# EAGLE design alimV1 (EAGLE 6.1)
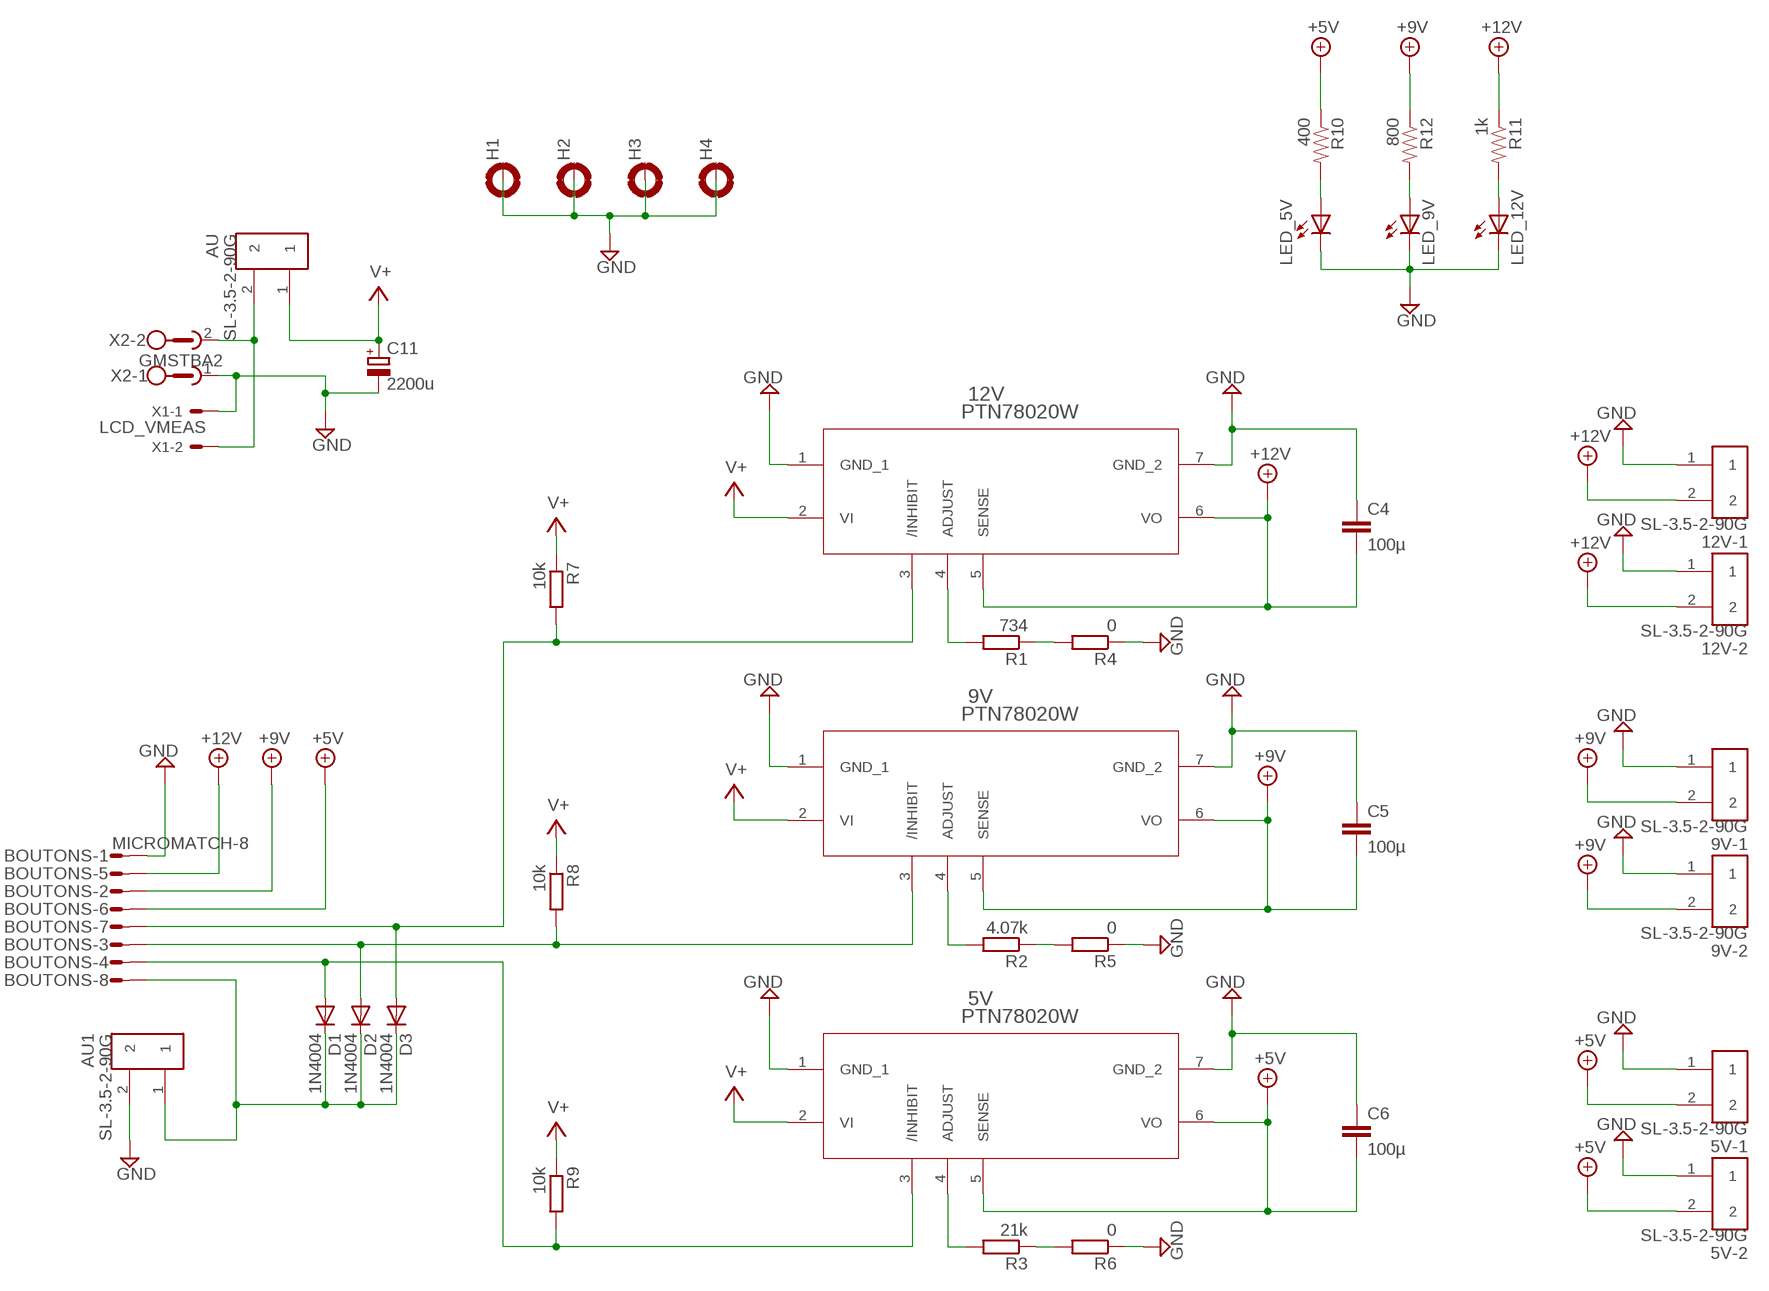
[diagram p0: schematic, sheet 1]

## Parts
5V  PTN78020W  [EUK7]
5V-1  SL-3.5-2-90G  [SL-3.5-2-90G]
5V-2  SL-3.5-2-90G  [SL-3.5-2-90G]
9V  PTN78020W  [EUK7]
9V-1  SL-3.5-2-90G  [SL-3.5-2-90G]
9V-2  SL-3.5-2-90G  [SL-3.5-2-90G]
12V  PTN78020W  [EUK7]
12V-1  SL-3.5-2-90G  [SL-3.5-2-90G]
12V-2  SL-3.5-2-90G  [SL-3.5-2-90G]
AU  SL-3.5-2-90G  [SL-3.5-2-90G]
AU1  SL-3.5-2-90G  [SL-3.5-2-90G]
BOUTONS  MICROMATCH-8  [MICROMATCH-8]
C4  100µ  C-EU025-025X050  [C025-025X050]
C5  100µ  C-EU025-025X050  [C025-025X050]
C6  100µ  C-EU025-025X050  [C025-025X050]
C11  2200u  CPOL-EUTT5D11  [TT5D11]
D1  1N4004  [DO41-10]
D2  1N4004  [DO41-10]
D3  1N4004  [DO41-10]
H1  MOUNT-PAD-ROUND3.2  [3,2-PAD]
H2  MOUNT-PAD-ROUND3.2  [3,2-PAD]
H3  MOUNT-PAD-ROUND3.2  [3,2-PAD]
H4  MOUNT-PAD-ROUND3.2  [3,2-PAD]
LED_5V  LEDCHIPLED_0805  [CHIPLED_0805]
LED_9V  LEDCHIPLED_0805  [CHIPLED_0805]
LED_12V  LEDCHIPLED_0805  [CHIPLED_0805]
R1  734  R-EU_R0805  [R0805]
R2  4.07k  R-EU_R0805  [R0805]
R3  21k  R-EU_R0805  [R0805]
R4  0  R-EU_R0805  [R0805]
R5  0  R-EU_R0805  [R0805]
R6  0  R-EU_R0805  [R0805]
R7  10k  R-EU_R0805  [R0805]
R8  10k  R-EU_R0805  [R0805]
R9  10k  R-EU_R0805  [R0805]
R10  400  RESISTOR0805-RES  [0805]
R11  1k  RESISTOR0805-RES  [0805]
R12  800  RESISTOR0805-RES  [0805]
X1  LCD_VMEAS  22-23-2021  [22-23-2021]
X2  GMSTBA2  [GMSTBA2]

## Nets
+5V: 5V-1.2 5V-2.2 5V.5(SENSE) 5V.6(VO) BOUTONS.6 C6.2 R10.1
+9V: 9V-1.2 9V-2.2 9V.5(SENSE) 9V.6(VO) BOUTONS.2 C5.2 R12.1
+12V: 12V-1.2 12V-2.2 12V.5(SENSE) 12V.6(VO) BOUTONS.5 C4.2 R11.1
GND: 5V-1.1 5V-2.1 5V.1(GND_1) 5V.7(GND_2) 9V-1.1 9V-2.1 9V.1(GND_1) 9V.7(GND_2) 12V-1.1 12V-2.1 12V.1(GND_1) 12V.7(GND_2) AU1.2 BOUTONS.1 C4.1 C5.1 C6.1 C11.- H1.B3,2(MOUNT) H2.B3,2(MOUNT) H3.B3,2(MOUNT) H4.B3,2(MOUNT) LED_5V.C LED_9V.C LED_12V.C R4.1 R5.1 R6.1 X1.1 X2.1
N$1: R3.1 R6.2
N$2: 12V.4(ADJUST) R1.2
N$3: 9V.4(ADJUST) R2.2
N$4: 5V.4(ADJUST) R3.2
N$5: R2.1 R5.2
N$6: R1.1 R4.2
N$7: 12V.3(/INHIBIT) BOUTONS.7 D3.A R7.2
N$8: 9V.3(/INHIBIT) BOUTONS.3 D2.A R8.2
N$9: 5V.3(/INHIBIT) BOUTONS.4 D1.A R9.2
N$10: AU1.1 BOUTONS.8 D1.C D2.C D3.C
N$11: AU.2 X1.2 X2.2
N$12: LED_5V.A R10.2
N$13: LED_12V.A R11.2
N$25: LED_9V.A R12.2
V+: 5V.2(VI) 9V.2(VI) 12V.2(VI) AU.1 C11.+ R7.1 R8.1 R9.1

## Library data of the parts
5V 9V 12V = PTN:PTN78020W
5V-1 5V-2 9V-1 9V-2 12V-1 12V-2 AU AU1 = WEIDMULLER:SL-3.5-2-90G
BOUTONS = con-amp-micromatch:MICROMATCH-8: MicroMaTch 8 7-215464-8 / 0-215464-8 Drawing Number C-215464 DDEController.pdf; MF: FARNELL; MPN: 7-215464-8; OC_FARNELL: 3784642; OC_NEWARK: 26H0301
C4-C6 = rcl:C-EU: CAPACITOR, European symbol
C11 = rcl:CPOL-EU: POLARIZED CAPACITOR, European symbol
D1-D3 = adafruit:1N4004: DIODE General purpose 1N400x type rectifier (With bigger pads) http://www.ladyada.net/library/pcb/eaglelibrary.html
H1-H4 = holes:MOUNT-PAD-ROUND: MOUNTING PAD, round
LED_5V LED_9V LED_12V = adafruit:LED: LED OSRAM: - CHIPLED LG R971, LG N971, LY N971, LG Q971, LY Q971, LO R971, LY R971 LH N974, LH R974 LS Q976, LO Q976, LY Q976 LO Q996 - Hyper CHIPLED LW Q18S LB Q993, LB Q99A, LB R99A - SideLED LS A670, LO A670, LY A670, LG A670, LP A670 LB A673, LV A673, LT A673, LW A673 LH A674 LY A675 LS A676, LA A676, LO A676, LY A676, LW A676 LS A679, LY A679, LG A679 - Hyper Micro SIDELED® LS Y876, LA Y876, LO Y876, LY Y876 LT Y87S - SmartLED LW L88C, LW L88S LB L89C, LB L89S, LG L890 LS L89K, LO L89K, LY L89K LS L896, LA L896, LO L896, LY L896 - TOPLED LS T670, LO T670, LY T670, LG T670, LP T670 LSG T670, LSP T670, LSY T670, LOP T670, LYG T670 LG T671, LOG T671, LSG T671 LB T673, LV T673, LT T673, LW T673 LH T674 LS T676, LA T676, LO T676, LY T676, LB T676, LH T676, LSB T676, LW T676 LB T67C, LV T67C, LT T67C, LS T67K, LO T67K, LY T67K, LW E67C LS E67B, LA E67B, LO E67B, LY E67B, LB E67C, LV E67C, LT E67C LW T67C LS T679, LY T679, LG T679 LS T770, LO T770, LY T770, LG T770, LP T770 LB T773, LV T773, LT T773, LW T773 LH T774 LS E675, LA E675, LY E675, LS T675 LS T776, LA T776, LO T776, LY T776, LB T776 LHGB T686 LT T68C, LB T68C - Hyper Mini TOPLED® LB M676 - Mini TOPLED Santana® LG M470 LS M47K, LO M47K, LY M47K Source: http://www.osram.convergy.de/
R1-R9 = rcl:R-EU_: RESISTOR, European symbol
R10-R12 = SparkFun-Passives:RESISTOR: Resistor Basic schematic elements and footprints for 0603, 1206, and PTH resistors.; OC_FARNELL: unknown
X1 = con-molex:22-23-2021: .100" (2.54mm) Center Header - 2 Pin; MF: MOLEX; MPN: 22-23-2021; OC_FARNELL: 1462926; OC_NEWARK: 25C3832
X2 = con-phoenix-762:GMSTBA2: PHOENIX; MF: FARNELL; MPN: 1757242; OC_FARNELL: 3705171; OC_NEWARK: 71C4161

## Board
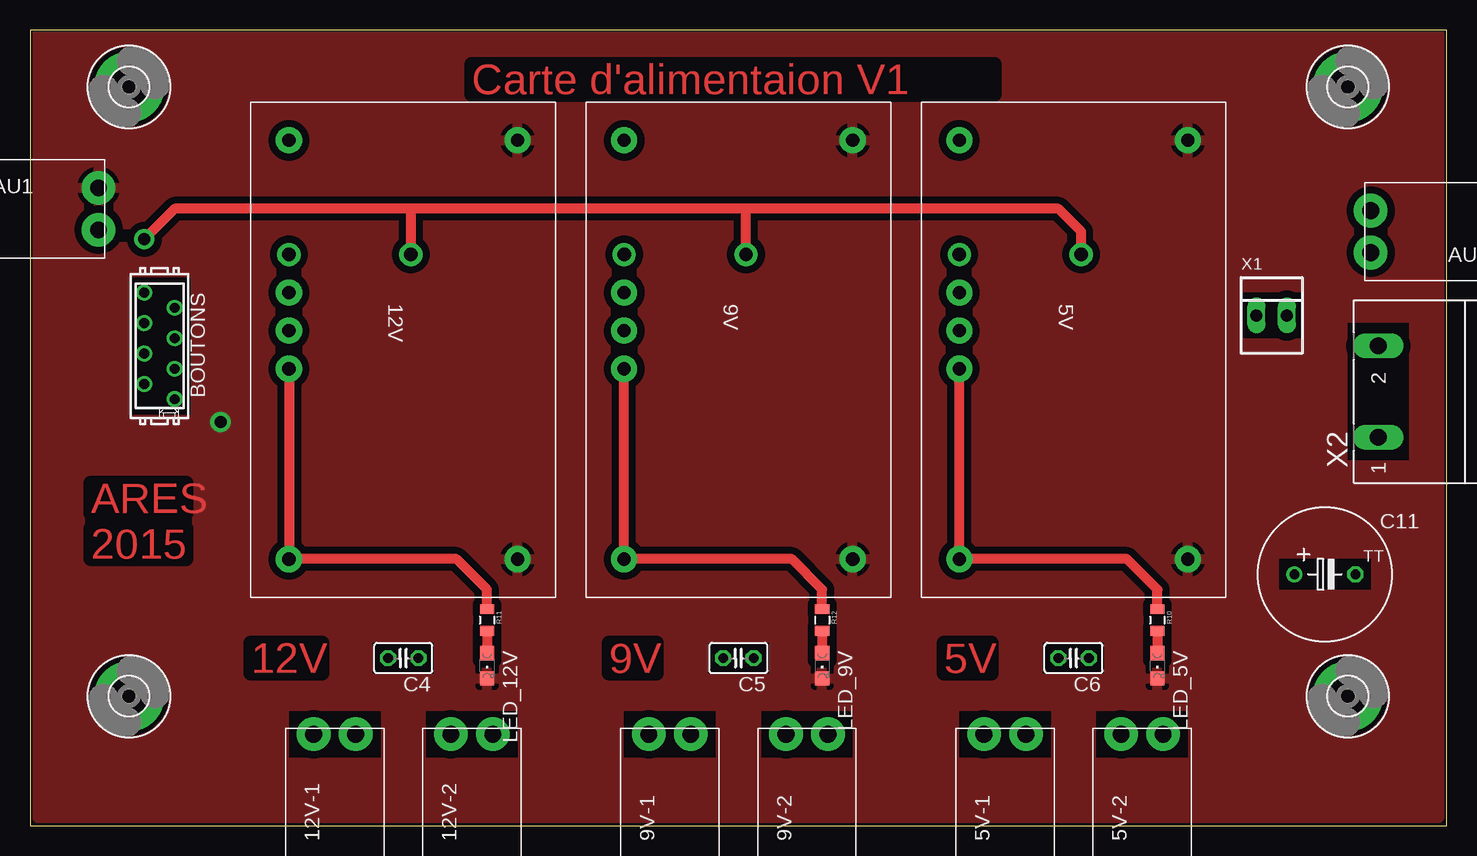
[diagram p1: board, top side]
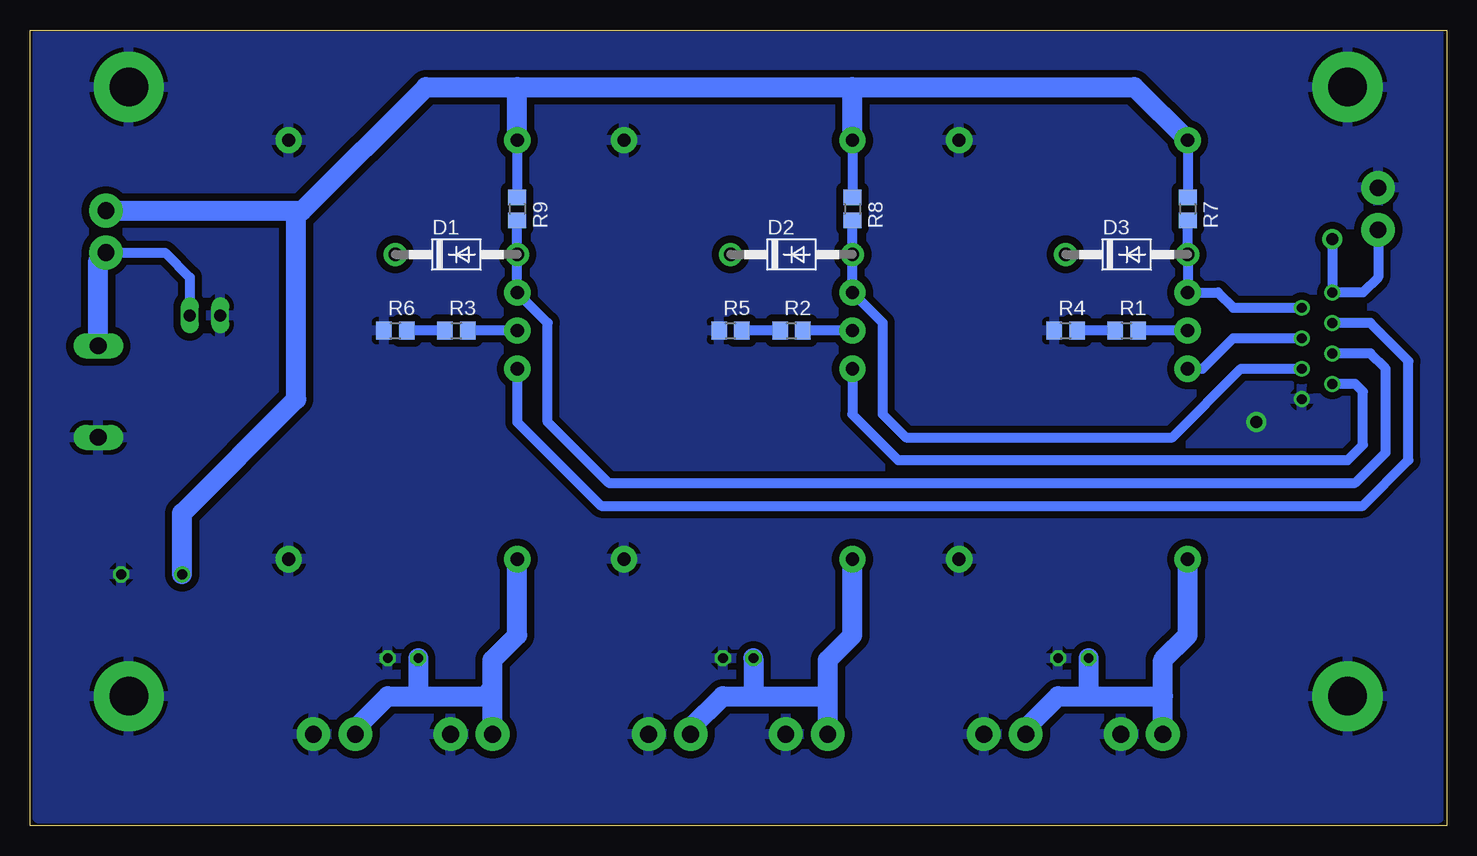
[diagram p2: board, bottom side, seen from below]

Size 118.09 x 66.34 mm. Coordinates in mm from the lower left corner, seen from the top.
Outline: 0,0 118.09,0 118.09,66.34 0,66.34 0,0
Copper layers (1*16): Top 0.035mm / dielectric 1.5mm / Bottom 0.035mm
Design rules: minimum track width 0.6mm, minimum drill 0.6mm, track to track 0.6mm, track to pad 0.6mm, pad to pad 0.6mm, via to via 0.6mm, smd to smd 0.6mm, copper to edge 4mil, drill to drill 1mm, minimum pad ring 10mil, minimum via ring 8mil, stop-mask expansion 4mil, vias tented up to drill 0mil, thermal gap 15mil
tRestrict: area 8.3,34.3 to 13.3,45.7; area 21.6,5.7 to 29.2,9.5; area 33,5.7 to 40.6,9.5; area 49.5,5.7 to 57.1,9.5; area 61,5.7 to 68.6,9.5; area 77.5,5.7 to 85.1,9.5; area 88.9,5.7 to 96.5,9.5; area 28.6,12.7 to 33.7,15.2; area 56.5,12.7 to 61.6,15.2; area 84.5,12.7 to 89.5,15.2; area 104.1,19.7 to 111.8,22.2; area 101,40.6 to 106,44.5; 1 more areas

### Footprints (pad centres in the part's own frame; a part is rotated, then mirrored left to right if it is on the bottom)
EUK7 = drill 1.1 pad 2.184: 1 0,0; 2 0,-19.05; 3 12.7,-19.05; 4 15.875,-19.05; 5 19.05,-19.05; 6 34.925,-19.05; 7 34.925,0
SL-3.5-2-90G = drill 1.4 pad 2.8: 1 0,-1.75; 2 0,1.75
MICROMATCH-8 = drill 0.813: 1 4.445,1.27; 2 3.175,-1.27; 3 1.905,1.27; 4 0.635,-1.27; 5 -0.635,1.27; 6 -1.905,-1.27; 7 -3.175,1.27; 8 -4.445,-1.27
C025-025X050 = drill 0.813 octagon: 1 -1.27,0; 2 1.27,0
TT5D11 = drill 0.813: + -2.54,0 | drill 0.813 octagon: - 2.54,0
DO41-10 = drill 1.118 pad 1.93: A 5.08,0; C -5.08,0
3,2-PAD = drill 3.2 pad 5.842: B3,2 0,0
CHIPLED_0805 = smd 1.2 x 1.2: A 0,-1.05; C 0,1.05
R0805 = smd 1.3 x 1.5: 1 -0.95,0; 2 0.95,0
0805 = smd 0.8 x 1.2: 1 -0.9,0; 2 0.9,0
22-23-2021 = drill 1 long: 1 -1.27,0; 2 1.27,0
GMSTBA2 = drill 1.397 long: 1 -3.81,5.08; 2 3.81,5.08

### Placement (x,y rotation side)
5V  96.52,57.15 270 top
5V-1  81.28,7.62 90 top
5V-2  92.71,7.62 90 top
9V  68.58,57.15 270 top
9V-1  53.34,7.62 90 top
9V-2  64.77,7.62 90 top
12V  40.64,57.15 270 top
12V-1  25.4,7.62 90 top
12V-2  36.83,7.62 90 top
AU  111.76,49.53 180 top
AU1  5.71,51.44 0 top
BOUTONS  10.79,40.01 270 top
C4  31.12,13.97 180 top
C5  59.05,13.97 180 top
C6  87,13.97 180 top
C11  107.95,20.95 0 top
D1  82.55,47.62 0 bottom
D2  54.61,47.62 0 bottom
D3  26.67,47.62 0 bottom
H1  8.25,10.79 0 top
H2  109.85,10.79 0 top
H3  109.85,61.59 0 top
H4  8.25,61.59 0 top
LED_5V  93.98,13.34 180 top
LED_9V  66.04,13.34 180 top
LED_12V  38.1,13.34 180 top
R1  26.67,41.27 0 bottom
R2  54.61,41.27 0 bottom
R3  82.55,41.27 0 bottom
R4  31.75,41.27 0 bottom
R5  59.69,41.27 0 bottom
R6  87.63,41.27 0 bottom
R7  21.59,51.44 270 bottom
R8  49.53,51.44 270 bottom
R9  77.47,51.44 270 bottom
R10  93.98,17.14 270 top
R11  38.1,17.14 270 top
R12  66.04,17.14 270 top
X1  103.5,42.55 0 top
X2  117.47,36.2 90 top

### Tracks (layer width: path | path; a pad name or v marks a point on that pad's centre or on a via)
+5V
  Top 0.813: 5V.5 5V.6 91.44,22.23 93.98,19.69 R10.1
  Bottom 0.813: 5V.5 77.47,33.66 70.49,26.67 6.98,26.67 3.17,30.48 3.17,38.73 6.35,41.91 BOUTONS.6
  Bottom 1.676: 5V-1.2 79.53,11.43 | 79.53,11.43 79.53,13.81 77.47,15.88 5V.6 | 5V-2.2 90.96,8.1 88.26,10.79 85.72,10.79 | 85.72,10.79 80.16,10.79 79.53,11.43 | C6.2 85.72,10.79
+9V
  Top 0.813: 9V.5 9V.6 63.5,22.23 66.04,19.69 R12.1
  Bottom 0.813: 9V.5 49.53,34.29 45.72,30.48 8.25,30.48 6.98,31.75 6.98,36.2 7.62,36.83 BOUTONS.2
  Bottom 1.676: 9V-1.2 51.59,10.79 | 51.59,10.79 51.59,13.81 49.53,15.88 9V.6 | 9V-2.2 63.02,8.1 60.32,10.79 57.78,10.79 | 57.78,10.79 51.59,10.79 | C5.2 57.78,10.79
+12V
  Top 0.813: R11.1 38.1,19.69 35.56,22.23 12V.6 12V.5
  Bottom 0.813: 12V.5 20.32,38.1 17.78,40.64 BOUTONS.5
  Bottom 1.676: 12V-1.2 23.65,10.79 | 23.65,10.79 23.65,13.81 21.59,15.88 12V.6 | 12V-2.2 35.08,8.1 32.38,10.79 29.84,10.79 | 29.84,10.79 23.65,10.79 | C4.2 29.84,10.79
GND  (via drill 1 pad 1.68)
  other vias: 15.88,33.66
  pour Top: 0.63,66.04 117.47,66.04 117.47,0.63 0.63,0.63
  pour Bottom: 0.63,66.04 117.47,66.04 117.47,0.63 0.63,0.63
N$1
  Bottom 0.813: R3.1 R6.2
N$2
  Bottom 0.813: 12V.4 R1.2
N$3
  Bottom 0.813: 9V.4 R2.2
N$4
  Bottom 0.813: 5V.4 R3.2
N$5
  Bottom 0.813: R2.1 R5.2
N$6
  Bottom 0.813: R1.1 R4.2
N$7
  Bottom 0.813: R7.2 D3.A 12V.3 19.05,44.45 17.78,43.18 BOUTONS.7
N$8
  Bottom 0.813: R8.2 D2.A 9V.3 46.99,41.91 46.99,34.29 45.09,32.38 22.86,32.38 17.14,38.1 BOUTONS.3
N$9
  Bottom 0.813: R9.2 D1.A 5V.3 74.93,41.91 74.93,33.66 69.85,28.58 7.62,28.58 5.08,31.12 5.08,38.1 6.35,39.37 BOUTONS.4
N$10  (via drill 1 pad 1.68)
  Top 0.813: D1.C 87.63,49.53 85.72,51.44 59.69,51.44 | 59.69,51.44 31.75,51.44 | 31.75,51.44 12.07,51.44 v9.53,48.9 | D2.C 59.69,51.44 | D3.C 31.75,51.44
  Bottom 0.813: v9.53,48.9 BOUTONS.8 6.98,44.45 5.71,45.72 AU1.1
N$11
  Bottom 0.813: AU.2 106.84,47.78 104.78,45.72 X1.2
  Bottom 1.676: X2.2 112.4,47.15 AU.2
N$12
  Top 0.813: R10.2 LED_5V.A
N$13
  Top 0.813: R11.2 LED_12V.A
N$25
  Top 0.813: R12.2 LED_9V.A
V+
  Bottom 0.813: 12V.2 R7.1 | 5V.2 R9.1 | 9V.2 R8.1
  Bottom 1.676: 77.47,61.59 49.53,61.59 | 49.53,61.59 26.04,61.59 12V.2 | 9V.2 49.53,61.59 | 5V.2 77.47,61.59 | AU.1 95.88,51.28 | 95.88,51.28 95.41,51.28 85.09,61.59 77.47,61.59 | C11.+ 105.41,26.04 95.88,35.56 95.88,51.28

### Text on the board
Top: Carte d'alimentaion V1 | ARES | 2015 | 12V | 9V | 5V